# EAGLE design rapidshark_mark_6.1 (EAGLE 6.5.0)
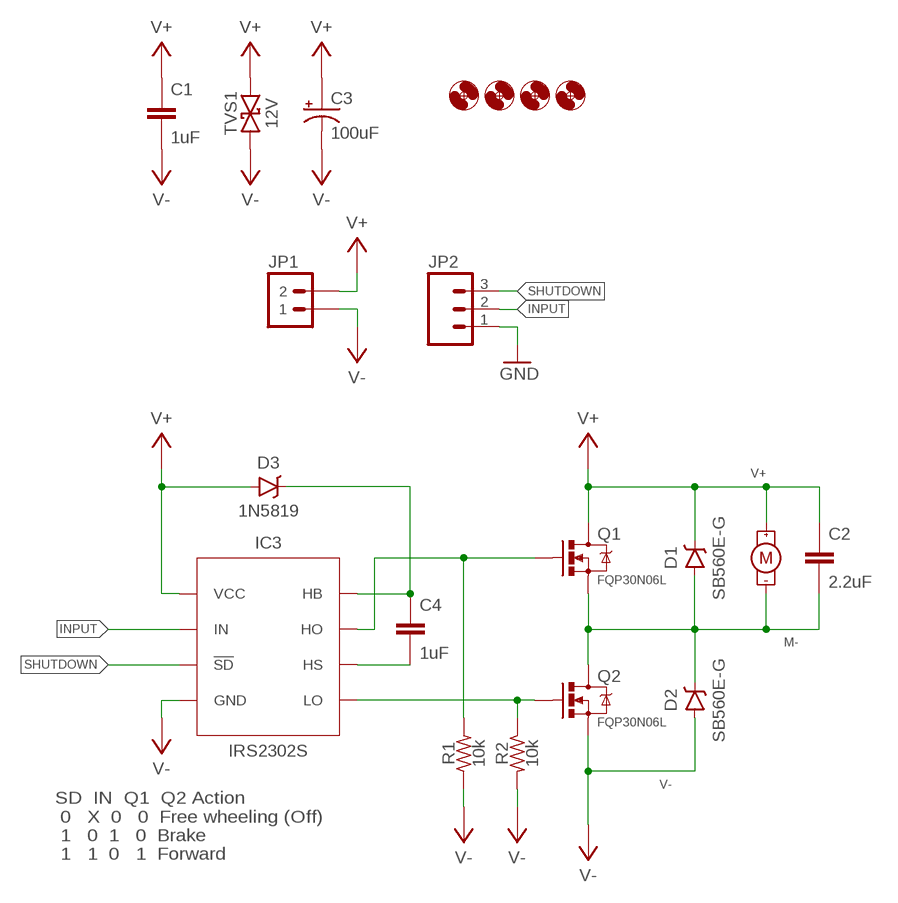
[diagram p0: schematic, sheet 1]

## Parts
C1  1uF  CAPACITOR-CERAMICC0805  [C0805]
C2  2.2uF  CAPACITOR-CERAMICC1206  [C1206]
C3  100uF  CAPACITOR-POLARIZEDE2.5-6-FLAT  [E2.5-6-FLAT]
C4  1uF  CAPACITOR-CERAMICC0805  [C0805]
D1  SB560E-G  DIODE-SCHOTTKYPTH-12.70-FAT  [DIODE-12.70MM-FAT]
D2  SB560E-G  DIODE-SCHOTTKYPTH-12.70-FAT  [DIODE-12.70MM-FAT]
D3  1N5819  DIODE-SCHOTTKYSMA  [SMA-DIODE-SCHOTTKY]
H1  HOLE#2  [HOLE-#2]
H2  HOLE#2  [HOLE-#2]
H3  HOLE#2  [HOLE-#2]
H4  HOLE#2  [HOLE-#2]
IC3  IRS2302S  [SO08]
JP1  M02PTH4  [1X02_XTRA_BIG]
JP2  M03JST-PTH  [JST-3-PH-RA-PTH]
M1  MOTORXTRA-BIG  [1X02_XTRA_BIG]
Q1  FQP30N06L  MOSFET-NCHANNELFQP30N06L-THERM  [TO-220-SIDE-THERM-ALT]
Q2  FQP30N06L  MOSFET-NCHANNELFQP30N06L-THERM  [TO-220-SIDE-THERM-ALT]
R1  10k  RESISTORR0805  [R0805]
R2  10k  RESISTORR0805  [R0805]
TVS1  12V  TVSDO-41-10.16MM  [DO-41-TVS-BI-10.16MM]

## Nets
GND: JP2.1
INPUT: IC3.2(IN) JP2.2
M-: C2.2 D1.A D2.K(C) M1.2(-) Q1.3(S) Q2.2(D) Q2.GND@1(D) Q2.GND@2(D) Q2.GND@3(D) Q2.GND@4(D) Q2.GND@5(D) Q2.GND@6(D) Q2.GND@7(D) Q2.GND@8(D) Q2.GND@9(D) Q2.GND@10(D) Q2.GND@11(D) Q2.GND@12(D) Q2.GND@13(D) Q2.GND@14(D) Q2.GND@15(D) Q2.GND@16(D) Q2.GND@17(D) Q2.GND@18(D) Q2.GND@19(D) Q2.GND@20(D) Q2.GND@21(D) Q2.GND@22(D) Q2.GND@23(D) Q2.GND@24(D) Q2.GND@25(D) Q2.GND@26(D) Q2.GND@27(D)
N$2: IC3.7(HO) Q1.1(G) R1.2
N$3: IC3.5(LO) Q2.1(G) R2.1
N$6: C4.1 D3.C IC3.8(HB)
N$7: C4.2 IC3.6(HS)
SHUTDOWN: IC3.3(!SD) JP2.3
V+: C1.1 C2.1 C3.+ D1.K(C) D3.A IC3.1(VCC) JP1.2 M1.1(+) Q1.2(D) Q1.GND@1(D) Q1.GND@2(D) Q1.GND@3(D) Q1.GND@4(D) Q1.GND@5(D) Q1.GND@6(D) Q1.GND@7(D) Q1.GND@8(D) Q1.GND@9(D) Q1.GND@10(D) Q1.GND@11(D) Q1.GND@12(D) Q1.GND@13(D) Q1.GND@14(D) Q1.GND@15(D) Q1.GND@16(D) Q1.GND@17(D) Q1.GND@18(D) Q1.GND@19(D) Q1.GND@20(D) Q1.GND@21(D) Q1.GND@22(D) Q1.GND@23(D) Q1.GND@24(D) Q1.GND@25(D) Q1.GND@26(D) Q1.GND@27(D) TVS1.P$1
V-: C1.2 C3.- D2.A IC3.4(GND) JP1.1 Q2.3(S) R1.1 R2.2 TVS1.P$2

## Notes on the sheet
- SD  IN  Q1  Q2 Action
   0   X  0   0  Free wheeling (Off)
   1   0  1   0  Brake
   1   1  0   1  Forward

## Library data of the parts
C1 C2 C4 = A_butts:CAPACITOR-CERAMIC: CAPACITOR, European symbol
C3 = A_butts:CAPACITOR-POLARIZED: POLARIZED CAPACITOR, American symbol
D1-D3 = A_butts:DIODE-SCHOTTKY: Schottky diodes in SFE's production catalog BAT20J 1A 23V 0.62Vf RB751 120mA 40V 0.37Vf PMEG4005EJ 0.5A 40V 0.42Vf MBRA140 1A 40V 0.5Vf B340A 3A 40V SMA
H1-H4 = A_butts:HOLE: MOUNTING HOLE with drill center marker
IC3 = A_butts:IRS2302S
JP1 = A_butts:M02: Standard 2-pin 0.1" header. Use with - straight break away headers ( PRT-00116) - right angle break away headers (PRT-00553) - swiss pins (PRT-00743) - machine pins (PRT-00117) - female headers (PRT-00115) Molex polarized connector foot print use with: PRT-08233 with associated crimp pins and housings. 2.54_SCREWTERM for use with PRT-10571. 3.5mm Screw Terminal footprints for PRT-08084 5mm Screw Terminal footprints for use with PRT-08433
JP2 = A_butts:M03: Header 3 Standard 3-pin 0.1" header. Use with straight break away headers (SKU : PRT-00116), right angle break away headers (PRT-00553), swiss pins (PRT-00743), machine pins (PRT-00117), and female headers (PRT-00115). Molex polarized connector foot print use with SKU : PRT-08232 with associated crimp pins and housings.; SKU: PRT-09915
M1 = A_butts:MOTOR: Brushed DC Motor Symbol for a motor combined with screw terminal output pads for hookup (since it's unlikely you're soldering the motor itself to a board :P).
Q1 Q2 = A_butts:MOSFET-NCHANNEL: Common NMOSFET Parts MFG P/N Store ID Prod ID FDD8780 TRANS-09984 SI7820DN TRANS-11055 FDS6630A IC-08089 2N7002PW TRANS-11151 FQP30N06L COM-10213 TRANS-10060 BSS123LT1G TRANS-08345 BSS138 TRANS-00830 BS170 2N7000
R1 R2 = A_butts:RESISTOR: RESISTOR, American symbol
TVS1 = A_butts:TVS: Transient voltage suppressor- prevents ESD on inputs. Ignore package description- MBRA140 is NOT this type of part!!!

## Board
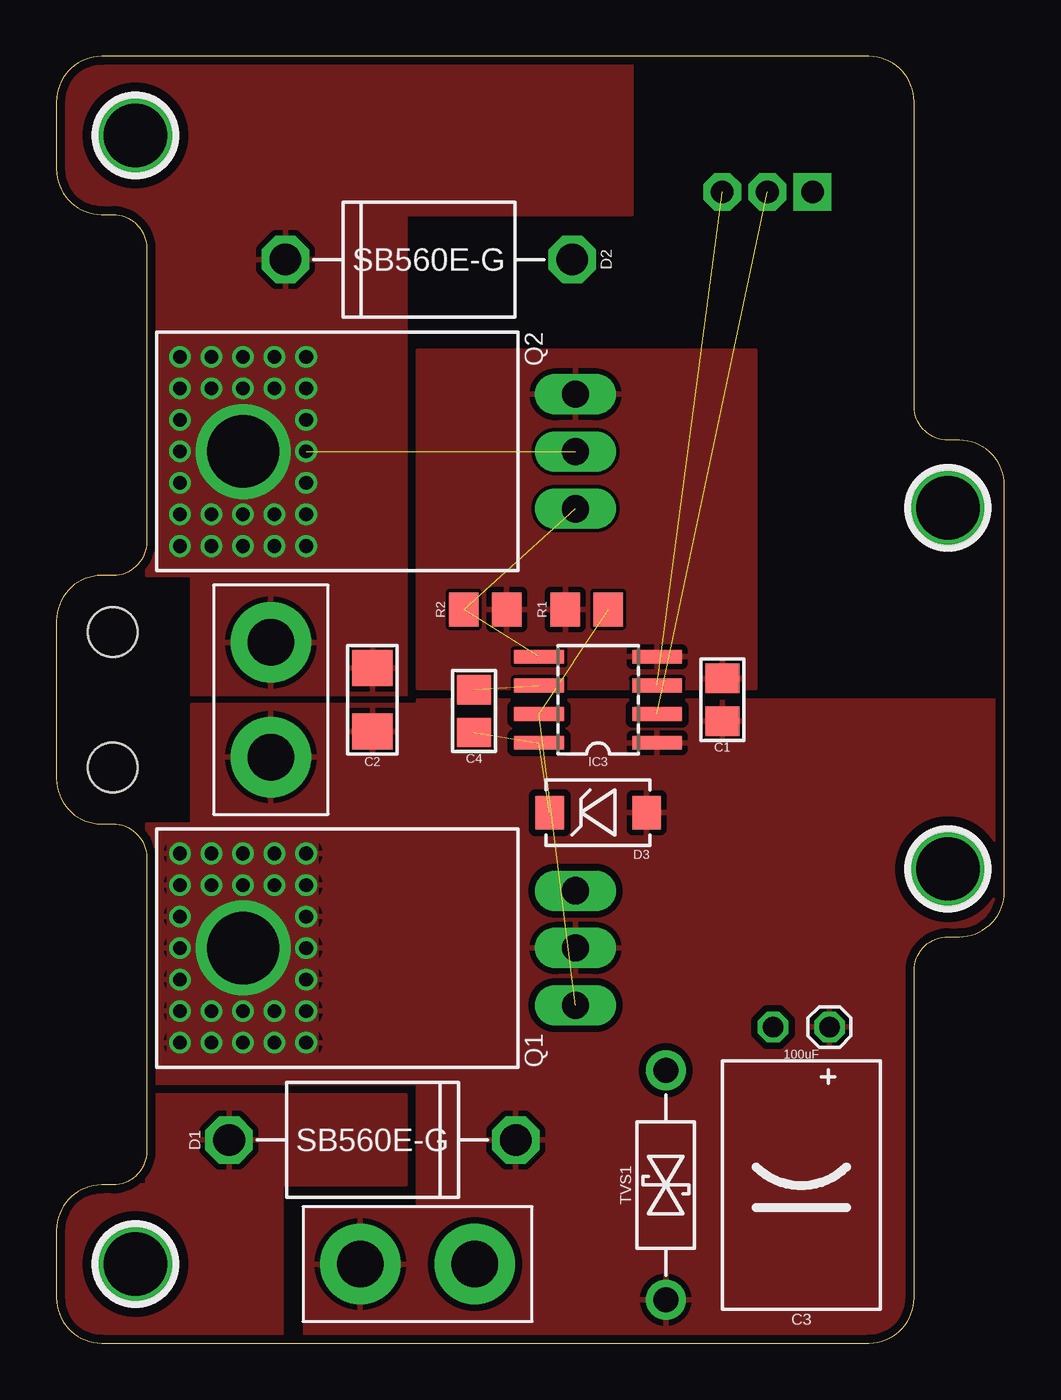
[diagram p1: board, top side]
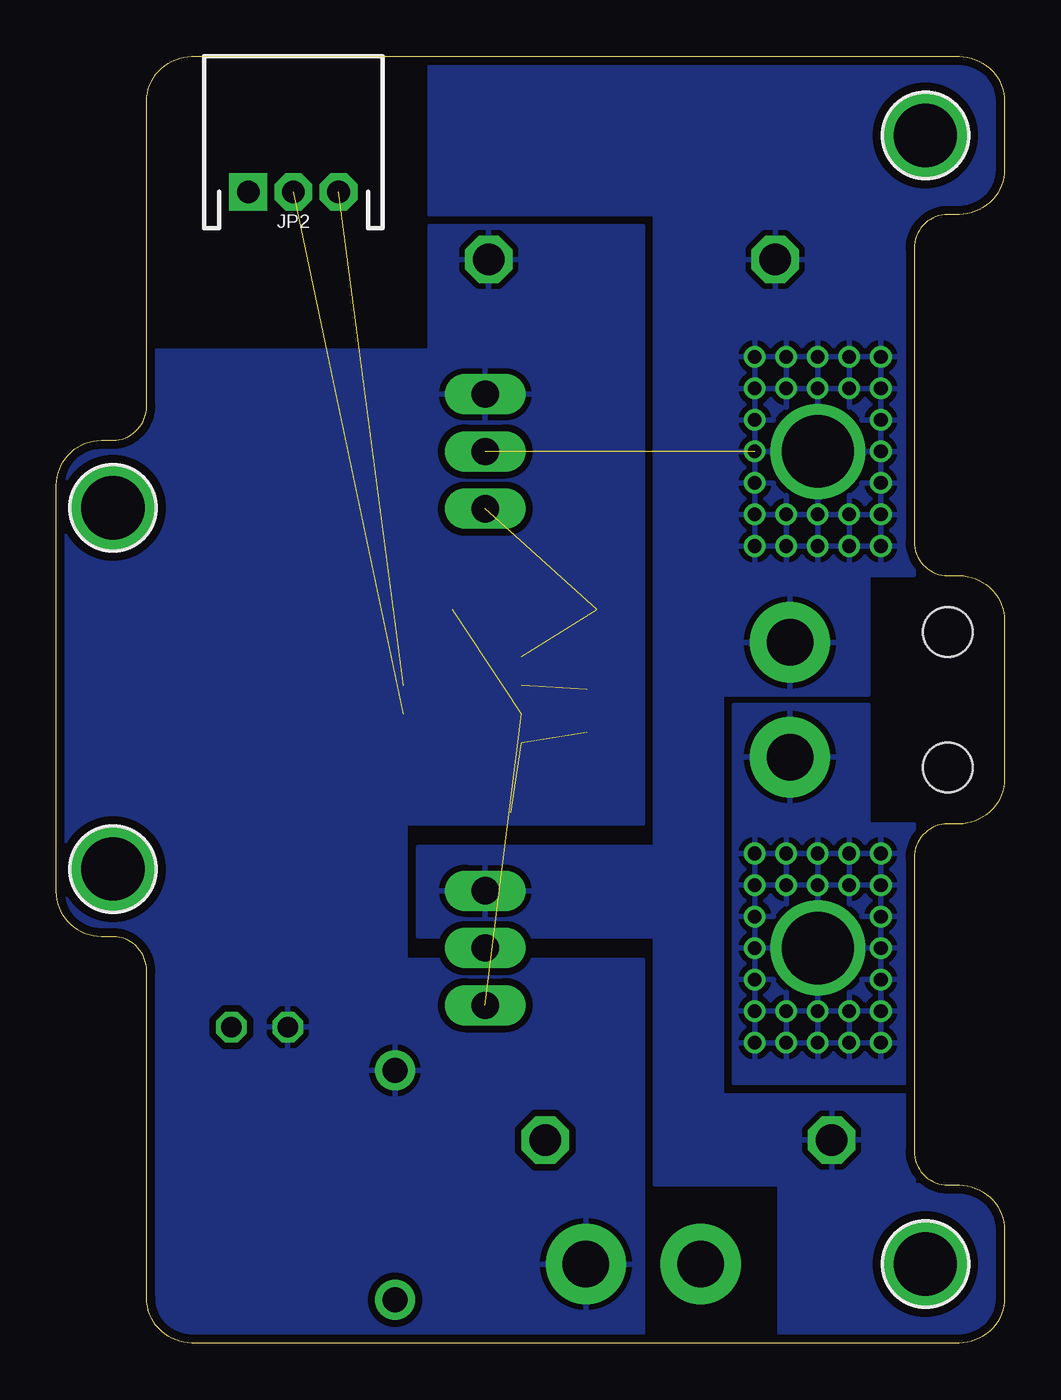
[diagram p2: board, bottom side, seen from below]

Size 42 x 57 mm. Coordinates in mm from the lower left corner, seen from the top.
Outline: 0,5 0,2 arc90 2,0 36,0 arc90 38,2 38,16.5 arc-90 39.5,18 40,18 arc90 42,20 42,38 arc90 40,40 39.5,40 arc-90 38,41.5 38,55 arc90 36,57 2,57 arc90 0,55 0,52 arc90 2,50 2.5,50 arc-90 4,48.5 4,35.5 arc-90 2.5,34 2,34 arc90 0,32 0,25 arc90 2,23 2.5,23 arc-90 4,21.5 4,8.5 arc-90 2.5,7 2,7 arc90 0,5
Copper layers (1*16): Top 0.0356mm / dielectric 1.5011mm / Bottom 0.0356mm
Design rules "LaenPCBOrder_2": minimum track width 6mil, minimum drill 13mil, track to track 6mil, track to pad 6mil, pad to pad 6mil, via to via 6mil, smd to smd 6mil, copper to edge 15mil, drill to drill 6mil, minimum pad ring 7mil, minimum via ring 7mil, stop-mask expansion 3mil, vias tented up to drill 20mil, thermal gap 10mil
Holes 2.2 mm at 2.5,31.5 2.5,25.5

### Footprints (pad centres in the part's own frame; a part is rotated, then mirrored left to right if it is on the bottom)
C0805 = smd 1.3 x 1.5: 1 -0.95,0; 2 0.95,0
C1206 = smd 1.6 x 1.8: 1 -1.4,0; 2 1.4,0
E2.5-6-FLAT = drill 0.9 octagon: + -1.25,0; - 1.25,0
DIODE-12.70MM-FAT = drill 1.4 octagon: A -6.35,0; K 6.35,0
SMA-DIODE-SCHOTTKY = smd 1.27 x 1.47: A -2.15,0; C 2.15,0
HOLE-#2 = drill 2.8 pad 3.81: P$1 0,0
SO08 = smd 0.61 x 2.21: 1 -1.905,-2.616; 2 -0.635,-2.616; 3 0.635,-2.616; 4 1.905,-2.616; 5 1.905,2.616; 6 0.635,2.616; 7 -0.635,2.616; 8 -1.905,2.616
1X02_XTRA_BIG = drill 2.057 pad 3.556: 1 -2.54,0; 2 2.54,0
JST-3-PH-RA-PTH = drill 1 pad 1.676 square: 1 -2,0 | drill 1 pad 1.676 octagon: 2 0,0; 3 2,0
TO-220-SIDE-THERM-ALT = drill 1.2 long: 1 -2.54,0; 2 0,0; 3 2.54,0 | drill 3.2: GND@1 0,14.732 | drill 0.6: GND@2 -4.191,13.335; GND@3 2.794,11.938; GND@4 -4.191,11.938; GND@5 -1.397,11.938; GND@6 1.397,11.938; GND@7 -2.794,11.938; GND@8 0,11.938; GND@9 -2.794,13.335; GND@10 -4.191,14.732; GND@11 -2.794,14.732; GND@12 -4.191,16.129; GND@13 -2.794,16.129; GND@14 4.191,11.938; GND@15 2.794,13.335; GND@16 4.191,13.335; GND@17 2.794,14.732; GND@18 4.191,14.732; GND@19 2.794,16.129; GND@20 4.191,16.129; GND@21 -4.191,17.526; GND@22 -2.794,17.526; GND@23 2.794,17.526; GND@24 4.191,17.526; GND@25 -1.397,17.526; GND@26 1.397,17.526; GND@27 0,17.526
R0805 = smd 1.3 x 1.5: 1 -0.95,0; 2 0.95,0
DO-41-TVS-BI-10.16MM = drill 1.1 pad 1.778: P$1 -5.08,0; P$2 5.08,0

### Placement (x,y rotation side)
C1  29.5,28.5 90 top
C2  14,28.5 90 top
C3  33,14 180 top
C4  18.5,28 90 top
D1  14,9 0 top
D2  16.5,48 180 top
D3  24,23.5 180 top
H1  3.5,3.5 0 top
H2  3.5,53.5 0 top
H3  39.5,21 0 top
H4  39.5,37 0 top
IC3  24,28.5 90 top
JP1  16,3.5 180 top
JP2  31.5,51 0 bottom
M1  9.5,28.5 90 top
Q1  23,17.5 90 top
Q2  23,39.5 90 top
R1  23.5,32.5 0 top
R2  19,32.5 0 top
TVS1  27,7 90 top

### Tracks (layer width: path | path; a pad name or v marks a point on that pad's centre or on a via)
INPUT  (1 unrouted)
M-  (1 unrouted)
  pour Top (isolate 0.3, rank 6): 4,34 4,48.5 arc90 2.5,50 2,50 arc-90 0,52 0,55 arc-90 2,57 25.5,57 25.5,50 15.5,50 15.5,28.7 6,28.7 6,34
  pour Top (isolate 0.3, rank 6): 4,11 15.5,11 15.5,7 10,7 10,0 0,0 0,7 4,7
  pour Top (no thermals): 4.5,44.5 4.5,34.5 12,34.5 12,44.5
  pour Bottom (isolate 0.3): 25.5,57 2,57 arc90 0,55 0,52 arc90 2,50 2.5,50 arc-90 4,48.5 4,34 6,34 6,28.7 12.5,28.7 12.5,11 4,11 4,7 0,7 0,0 10,0 10,7 15.5,7 15.5,18 26,18 26,22 15.5,22 15.5,50 25.5,50
N$2  (2 unrouted)
N$3  (2 unrouted)
N$6  (2 unrouted)
N$7  (1 unrouted)
SHUTDOWN  (1 unrouted)
V+
  pour Top (isolate 0.3): 16,28.5 16,28.3 6,28.3 6,23 4,23 4,11.5 16,11.5 16,6 11,6 11,0 36,0 arc90 38,2 38,16.5 arc-90 39.5,18 40,18 arc90 42,20 42,28.5
  pour Top (no thermals): 5,22.5 5,12.5 11.5,12.5 11.5,22.5
  pour Bottom: 4,11.5 12,11.5 12,28.3 6,28.3 6,23 4,23
V-
  pour Bottom (isolate 0.3): 16,49.5 16,23 26.5,23 26.5,17 16,17 16,0 36,0 arc90 38,2 38,16.5 arc-90 39.5,18 40,18 arc90 42,20 42,38 arc90 40,40 39.5,40 arc-90 38,41.5 38,44 25.5,44 25.5,49.5
  pour Top: 16,29 31,29 31,44 16,44